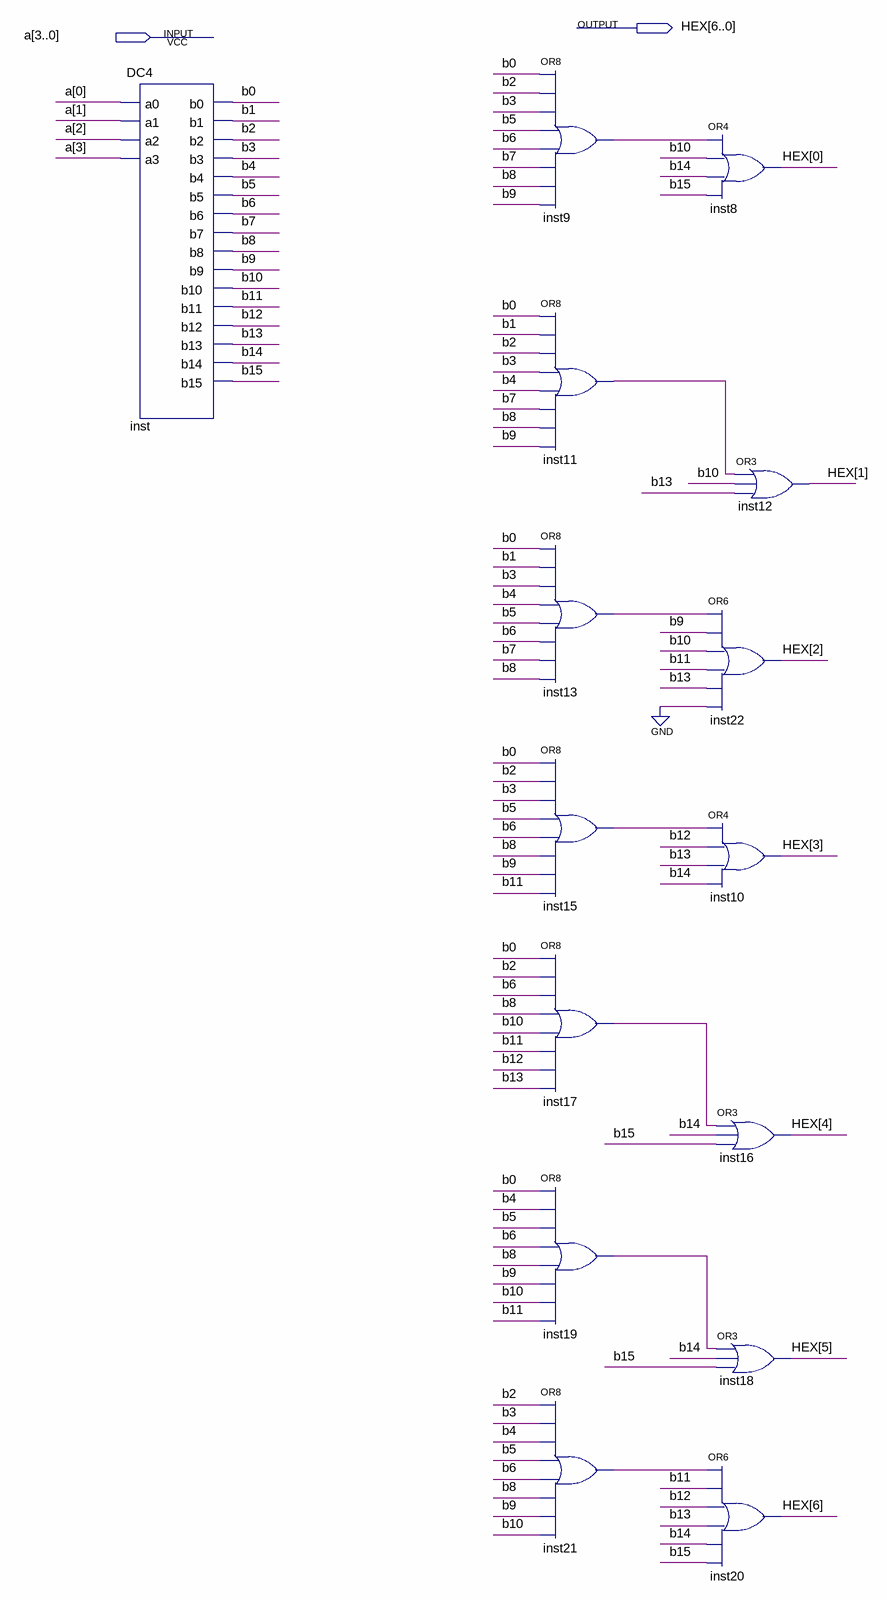
[diagram p0: schematic sheet]
// Quartus schematic sevenseg.bdf as structural Verilog: 15 symbols, 2 pins
module sevenseg (
  input  [3:0] a,
  output [6:0] HEX
);

  wire b0, b1, b2, b3, b4, b5, b6, b7, b8, b9, b10, b11, b12, b13, b14, b15, inst9_out, inst11_out,
       inst13_out, inst15_out, inst17_out, inst19_out, inst21_out;

  DC4 inst (
    .a0(a[0]), .a1(a[1]), .a2(a[2]), .a3(a[3]), .b0(b0), .b1(b1), .b2(b2), .b3(b3), .b4(b4), .b5(b5),
    .b6(b6), .b7(b7), .b8(b8), .b9(b9), .b10(b10), .b11(b11), .b12(b12), .b13(b13), .b14(b14), .b15(b15));
  or inst9 (inst9_out, b0, b2, b3, b5, b6, b7, b8, b9);
  or inst11 (inst11_out, b0, b1, b2, b3, b4, b7, b8, b9);
  or inst13 (inst13_out, b0, b1, b3, b4, b5, b6, b7, b8);
  or inst15 (inst15_out, b0, b2, b3, b5, b6, b8, b9, b11);
  or inst17 (inst17_out, b0, b2, b6, b8, b10, b11, b12, b13);
  or inst19 (inst19_out, b0, b4, b5, b6, b8, b9, b10, b11);
  or inst21 (inst21_out, b2, b3, b4, b5, b6, b8, b9, b10);
  or inst8 (HEX[0], inst9_out, b10, b14, b15);
  or inst12 (HEX[1], inst11_out, b10, b13);
  or inst22 (HEX[2], inst13_out, b9, b10, b11, b13, 1'b0);
  or inst10 (HEX[3], inst15_out, b12, b13, b14);
  or inst16 (HEX[4], inst17_out, b14, b15);
  or inst18 (HEX[5], inst19_out, b14, b15);
  or inst20 (HEX[6], inst21_out, b11, b12, b13, b14, b15);
endmodule
